# EAGLE schematic powersource_for_Heater (EAGLE 9.2.2)
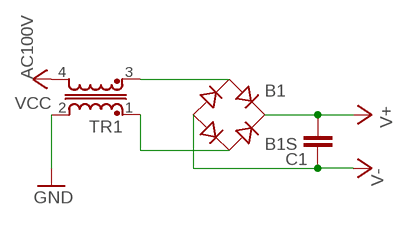
[diagram p0: schematic, sheet 1]

## Parts
B1  B1S  [MBS]
C1  C10/5  [C10B5]
TR1  U15-TRANSFORMER  [U15]

## Nets
GND: TR1.2
N$1: B1.AC1 TR1.3
N$2: B1.AC2 TR1.1
V+: B1.+ B1.- C1.1 C1.2
VCC: TR1.4

## Library data of the parts
B1 = rectifier:B*S: Surface Mount Glass Passivated Bridge Rectifiers Source: Comchip Bridge Rectifiers B05S-G_B10S-G.pdf
C1 = capacitor-wima:C: CAPACITOR naming: grid - package width
TR1 = inductor-neosid:U15: TRANSFORMER U15; OC_FARNELL: unknown; OC_NEWARK: unknown